# Altium project lite.PrjPcb
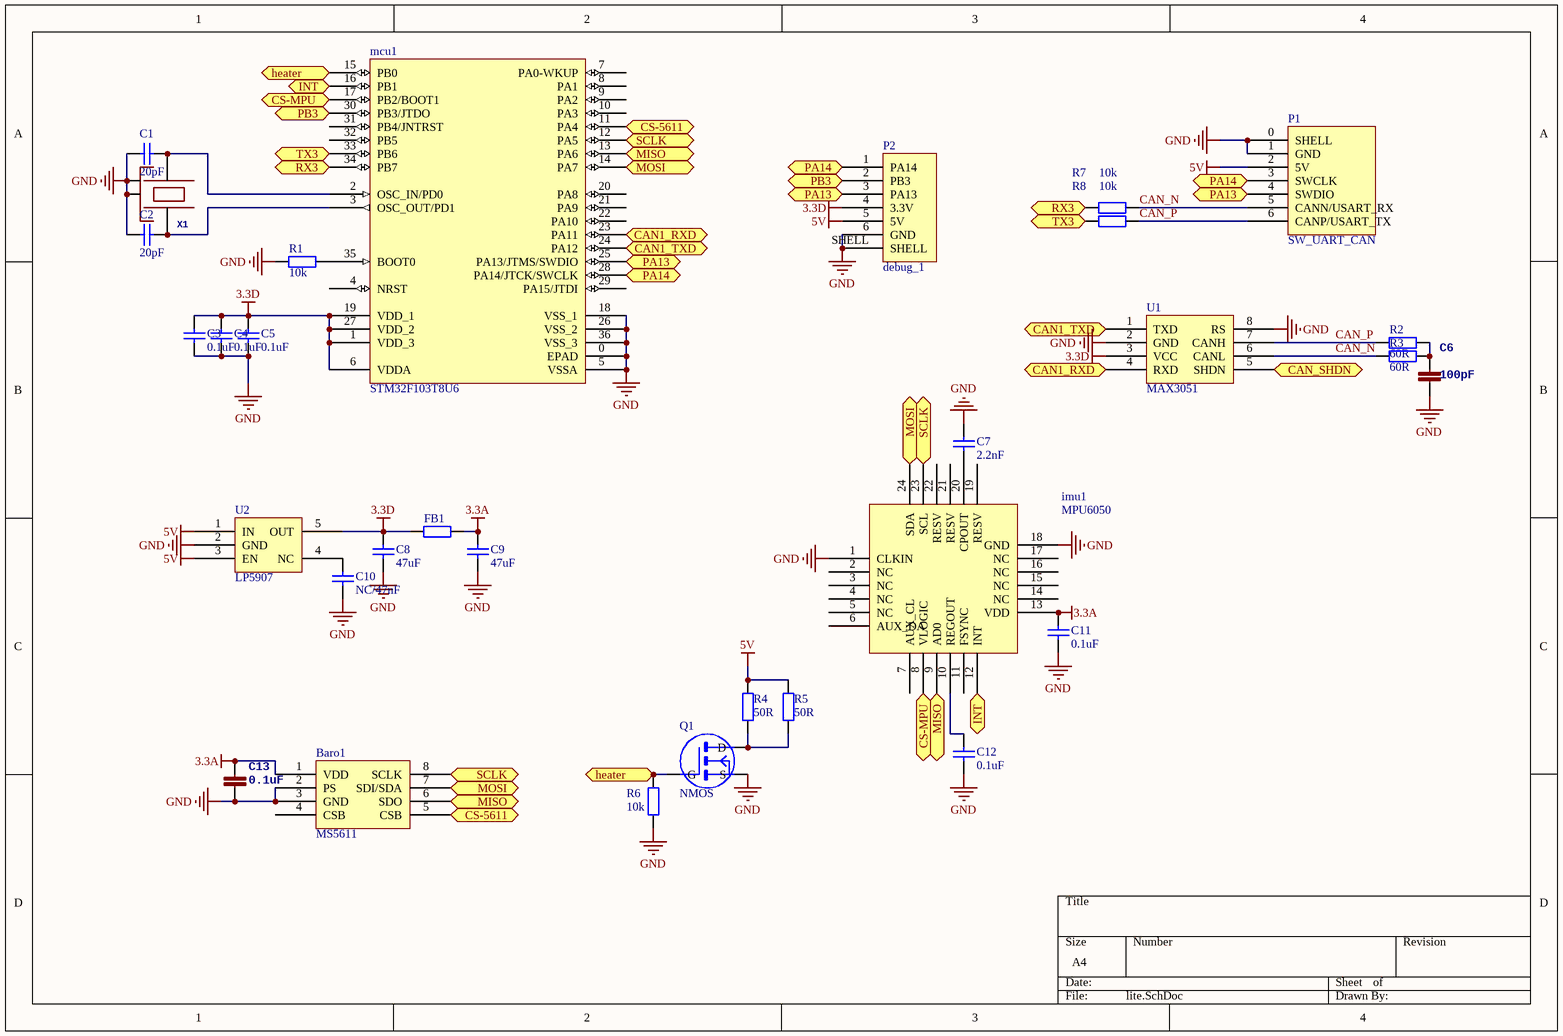
[diagram p0: lite.SchDoc]
1 sheet, 31 parts. Net scope: flat (ports and power ports of the same name join across sheets).
Board file: lite.PcbDoc

## Sheet lite.SchDoc
size A4

### Parts
Baro1  MS5611  [MS5611]
C1  value 20pF  [0402]  (hidden comment: Cap)
C2  value 20pF  [0402]  (hidden comment: Cap)
C3  value 0.1uF  [0402]  (hidden comment: Cap)
C4  value 0.1uF  [0402]  (hidden comment: Cap)
C5  value 0.1uF  [0402]  (hidden comment: Cap)
C6  100pF  [0402]
C7  2.2nF  [0402]
C8  value 47uF  [0805]  (hidden comment: Cap)
C9  value 47uF  [0805]  (hidden comment: Cap)
C10  value NC/47nF  [0402]  (hidden comment: Cap)
C11  0.1uF  [0402]
C12  0.1uF  [0402]
C13  0.1uF  [0402]
FB1  Res2  [0402]  (value not drawn)
imu1  MPU6050  [MPU6050-2]
mcu1  STM32F103T8U6  [VFQN36_V]
P1  SW_UART_CAN  [FPC-0.5mm-6]
P2  debug_1  [WFRSM125]
Q1  NMOS  [SOT-23B_L]
R1  value 10k  [0402]  (hidden comment: Res2)
R2  60R  [0402]
R3  60R  [0402]
R4  value 50R  [0805]  (hidden comment: Res2)
R5  value 50R  [0805]  (hidden comment: Res2)
R6  value 10k  [0402]  (hidden comment: Res2)
R7  value 10k  [0402]  (hidden comment: Res2)
R8  value 10k  [0402]  (hidden comment: Res2)
U1  MAX3051  [SOT-8]
U2  LP5907  [SOT23-5]
X1  24.000 KHz 3.2x2.5mm 8-10pf  [OSCILLATOR-3.2X2.5]  (value not drawn)

### Ports
CAN1_RXD, CAN1_TXD, CAN_SHDN, CS-5611, CS-MPU, heater, INT, MISO, MOSI, PA13, PA14, PB3, RX3, SCLK, TX3

### Nets
3.3A: Baro1.1(VDD) C9.1 C11.2 C13.1 FB1.1 imu1.13(VDD)
3.3D: C3.2 C4.2 C5.2 C8.1 FB1.2 mcu1.1(VDD_3) mcu1.6(VDDA) mcu1.19(VDD_1) mcu1.27(VDD_2) P2.4(3.3V) U1.3(VCC) U2.5(OUT)
5V: P1.2(5V) P2.5(5V) R4.1 R5.1 U2.1(IN) U2.3(EN)
GND: Baro1.2(PS) Baro1.3(GND) C1.1 C2.1 C3.1 C4.1 C5.1 C6.1 C7.2 C8.2 C9.2 C10.2 C11.1 C12.1 C13.2 imu1.1(CLKIN) imu1.18(GND) mcu1.0(EPAD) mcu1.5(VSSA) mcu1.18(VSS_1) mcu1.26(VSS_2) mcu1.36(VSS_3) P1.0(SHELL) P1.1(GND) P2.6(GND) P2.SHELL Q1.S R1.2 R6.2 U1.2(GND) U1.8(RS) U2.2(GND) X1.2(NC_2) X1.4(NC_4)
CAN_N: P1.5(CANN/USART_RX) R3.2 R7.1 U1.6(CANL)
CAN_P: P1.6(CANP/USART_TX) R2.2 R8.1 U1.7(CANH)
NetBaro1_5: Baro1.5(CSB) mcu1.11(PA4) ; port CS-5611
NetBaro1_6: Baro1.6(SDO) imu1.9(AD0) mcu1.13(PA6) ; port MISO
NetBaro1_7: Baro1.7(SDI/SDA) imu1.24(SDA) mcu1.14(PA7) ; port MOSI
NetBaro1_8: Baro1.8(SCLK) imu1.23(SCL) mcu1.12(PA5) ; port SCLK
NetC1_2: C1.2 mcu1.2(OSC_IN/PD0) X1.1
NetC2_2: C2.2 mcu1.3(OSC_OUT/PD1) X1.3
NetC6_2: C6.2 R2.1 R3.1
NetC7_1: C7.1 imu1.20(CPOUT)
NetC10_1: C10.1 U2.4(NC)
NetC12_2: C12.2 imu1.10(REGOUT)
Netimu1_8: imu1.8(VLOGIC) mcu1.17(PB2/BOOT1) ; port CS-MPU
Netimu1_12: imu1.12(INT) mcu1.16(PB1) ; port INT
Netmcu1_15: mcu1.15(PB0) Q1.G R6.1 ; port heater
Netmcu1_23: mcu1.23(PA11) U1.4(RXD) ; port CAN1_RXD
Netmcu1_24: mcu1.24(PA12) U1.1(TXD) ; port CAN1_TXD
Netmcu1_25: mcu1.25(PA13/JTMS/SWDIO) P1.4(SWDIO) P2.3(PA13) ; port PA13
Netmcu1_28: mcu1.28(PA14/JTCK/SWCLK) P1.3(SWCLK) P2.1(PA14) ; port PA14
Netmcu1_30: mcu1.30(PB3/JTDO) P2.2(PB3) ; port PB3
Netmcu1_33: mcu1.33(PB6) R8.2 ; port TX3
Netmcu1_34: mcu1.34(PB7) R7.2 ; port RX3
Netmcu1_35: mcu1.35(BOOT0) R1.1
NetQ1_D: Q1.D R4.2 R5.2
NetU1_5: U1.5(SHDN) ; port CAN_SHDN

Not connected (* = marked no-connect by the designer): Baro1 4(CSB); imu1 2(NC) 3(NC) 4(NC) 5(NC) 6(AUX_DA) 7(AUX_CL) 11(FSYNC) 14(NC) 15(NC) 16(NC) 17(NC) 19(RESV) 21(RESV) 22(RESV); mcu1 4(NRST) 7(PA0-WKUP) 8(PA1) 9(PA2) 10(PA3) 20(PA8) 21(PA9) 22(PA10) 29(PA15/JTDI) 31(PB4/JNTRST) 32(PB5)

### Library data of the parts
C1-C5 C8-C12 = Cap: Capacitor; Published: 8-Jun-2000; LatestRevisionDate: 17-Jul-2002; LatestRevisionNote: Re-released for DXP Platform.; PackageReference: RAD-0.3; Publisher: Altium Limited; PackageDescription: Radial Cap, Thru-Hole; 2 Leads; 0.3 in Pin Spacing
  C11 C12: Value: 0.1uf
C6 = CAP0402-CAP: 电容; PARTNO: CC0402ZRY5V7BB104
C7 = Cap: Capacitor; Value: 0.1uf; Published: 8-Jun-2000; LatestRevisionDate: 17-Jul-2002; LatestRevisionNote: Re-released for DXP Platform.; PackageReference: RAD-0.3; Publisher: Altium Limited; PackageDescription: Radial Cap, Thru-Hole; 2 Leads; 0.3 in Pin Spacing
C13 = CAP0402-CAP: <b>Capacitor</b> / Standard 0603 ceramic capacitor, and 0.1" leaded capacitor.; PARTNO: CC0402ZRY5V7BB104
FB1 = Res2: Resistor; Value: 10k; Published: 8-Jun-2000; LatestRevisionDate: 17-Jul-2002; LatestRevisionNote: Re-released for DXP Platform.; PackageReference: AXIAL-0.4; Publisher: Altium Limited; PackageDescription: Axial Device, Thru-Hole; 2 Leads; 0.4 in Pin Spacing
mcu1 = STM32F103T8U6: STM32 ARM-based 32-bit MCU with 64 Kbytes Flash, 36-pin VFQFPN, Industrial Temperature; Published: *; DatasheetVersion: *; PackageVersion: *; PackageReference: *; Publisher: *; PackageDescription: *; ComponentLink1Description: *; ComponentLink1URL: *; ComponentLink2Description: *; ComponentLink2URL: *
Q1 = NMOS: pin to pad: D>3 G>1 S>2
R1 R4-R8 = Res2: Resistor; Published: 8-Jun-2000; LatestRevisionDate: 17-Jul-2002; LatestRevisionNote: Re-released for DXP Platform.; PackageReference: AXIAL-0.4; Publisher: Altium Limited; PackageDescription: Axial Device, Thru-Hole; 2 Leads; 0.4 in Pin Spacing
R2 R3 = Res2: 电阻; Value: 0Ohm; Published: 8-Jun-2000; LatestRevisionDate: 17-Jul-2002; LatestRevisionNote: Re-released for DXP Platform.; PackageReference: AXIAL-0.4; Publisher: Altium Limited; PackageDescription: Axial Device, Thru-Hole; 2 Leads; 0.4 in Pin Spacing
X1 = OSCILLATOR-3.2X2.5: Crystal Oscillator in 3.2x2.5 SMD